# EAGLE schematic ABE-Stat1_01_02 (EAGLE 8.4.3)
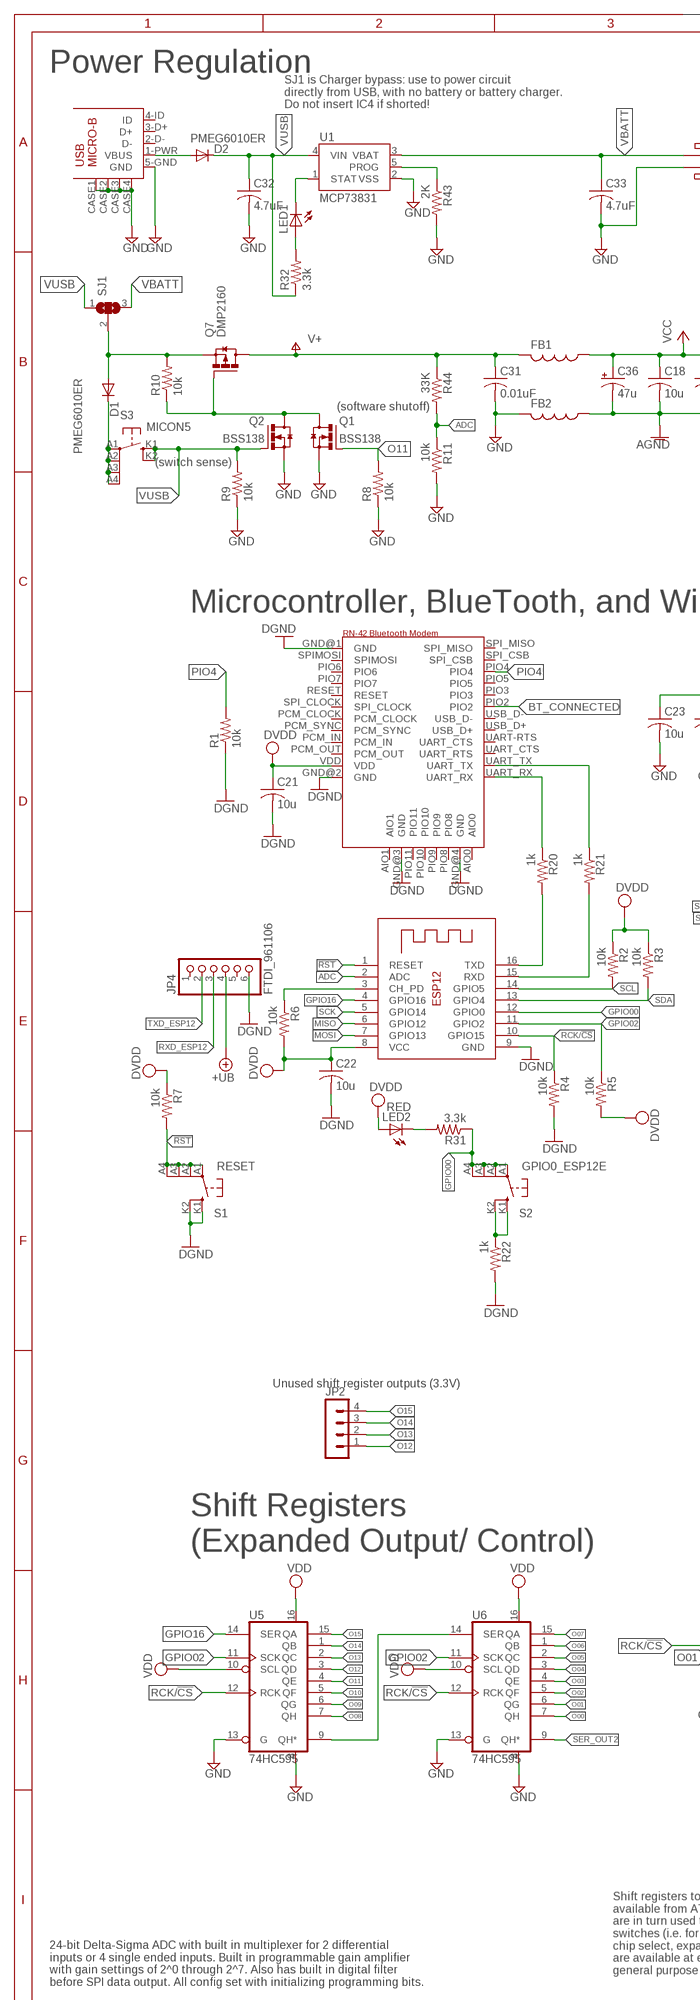
[diagram p0: schematic, sheet 1, part 1 of 2]
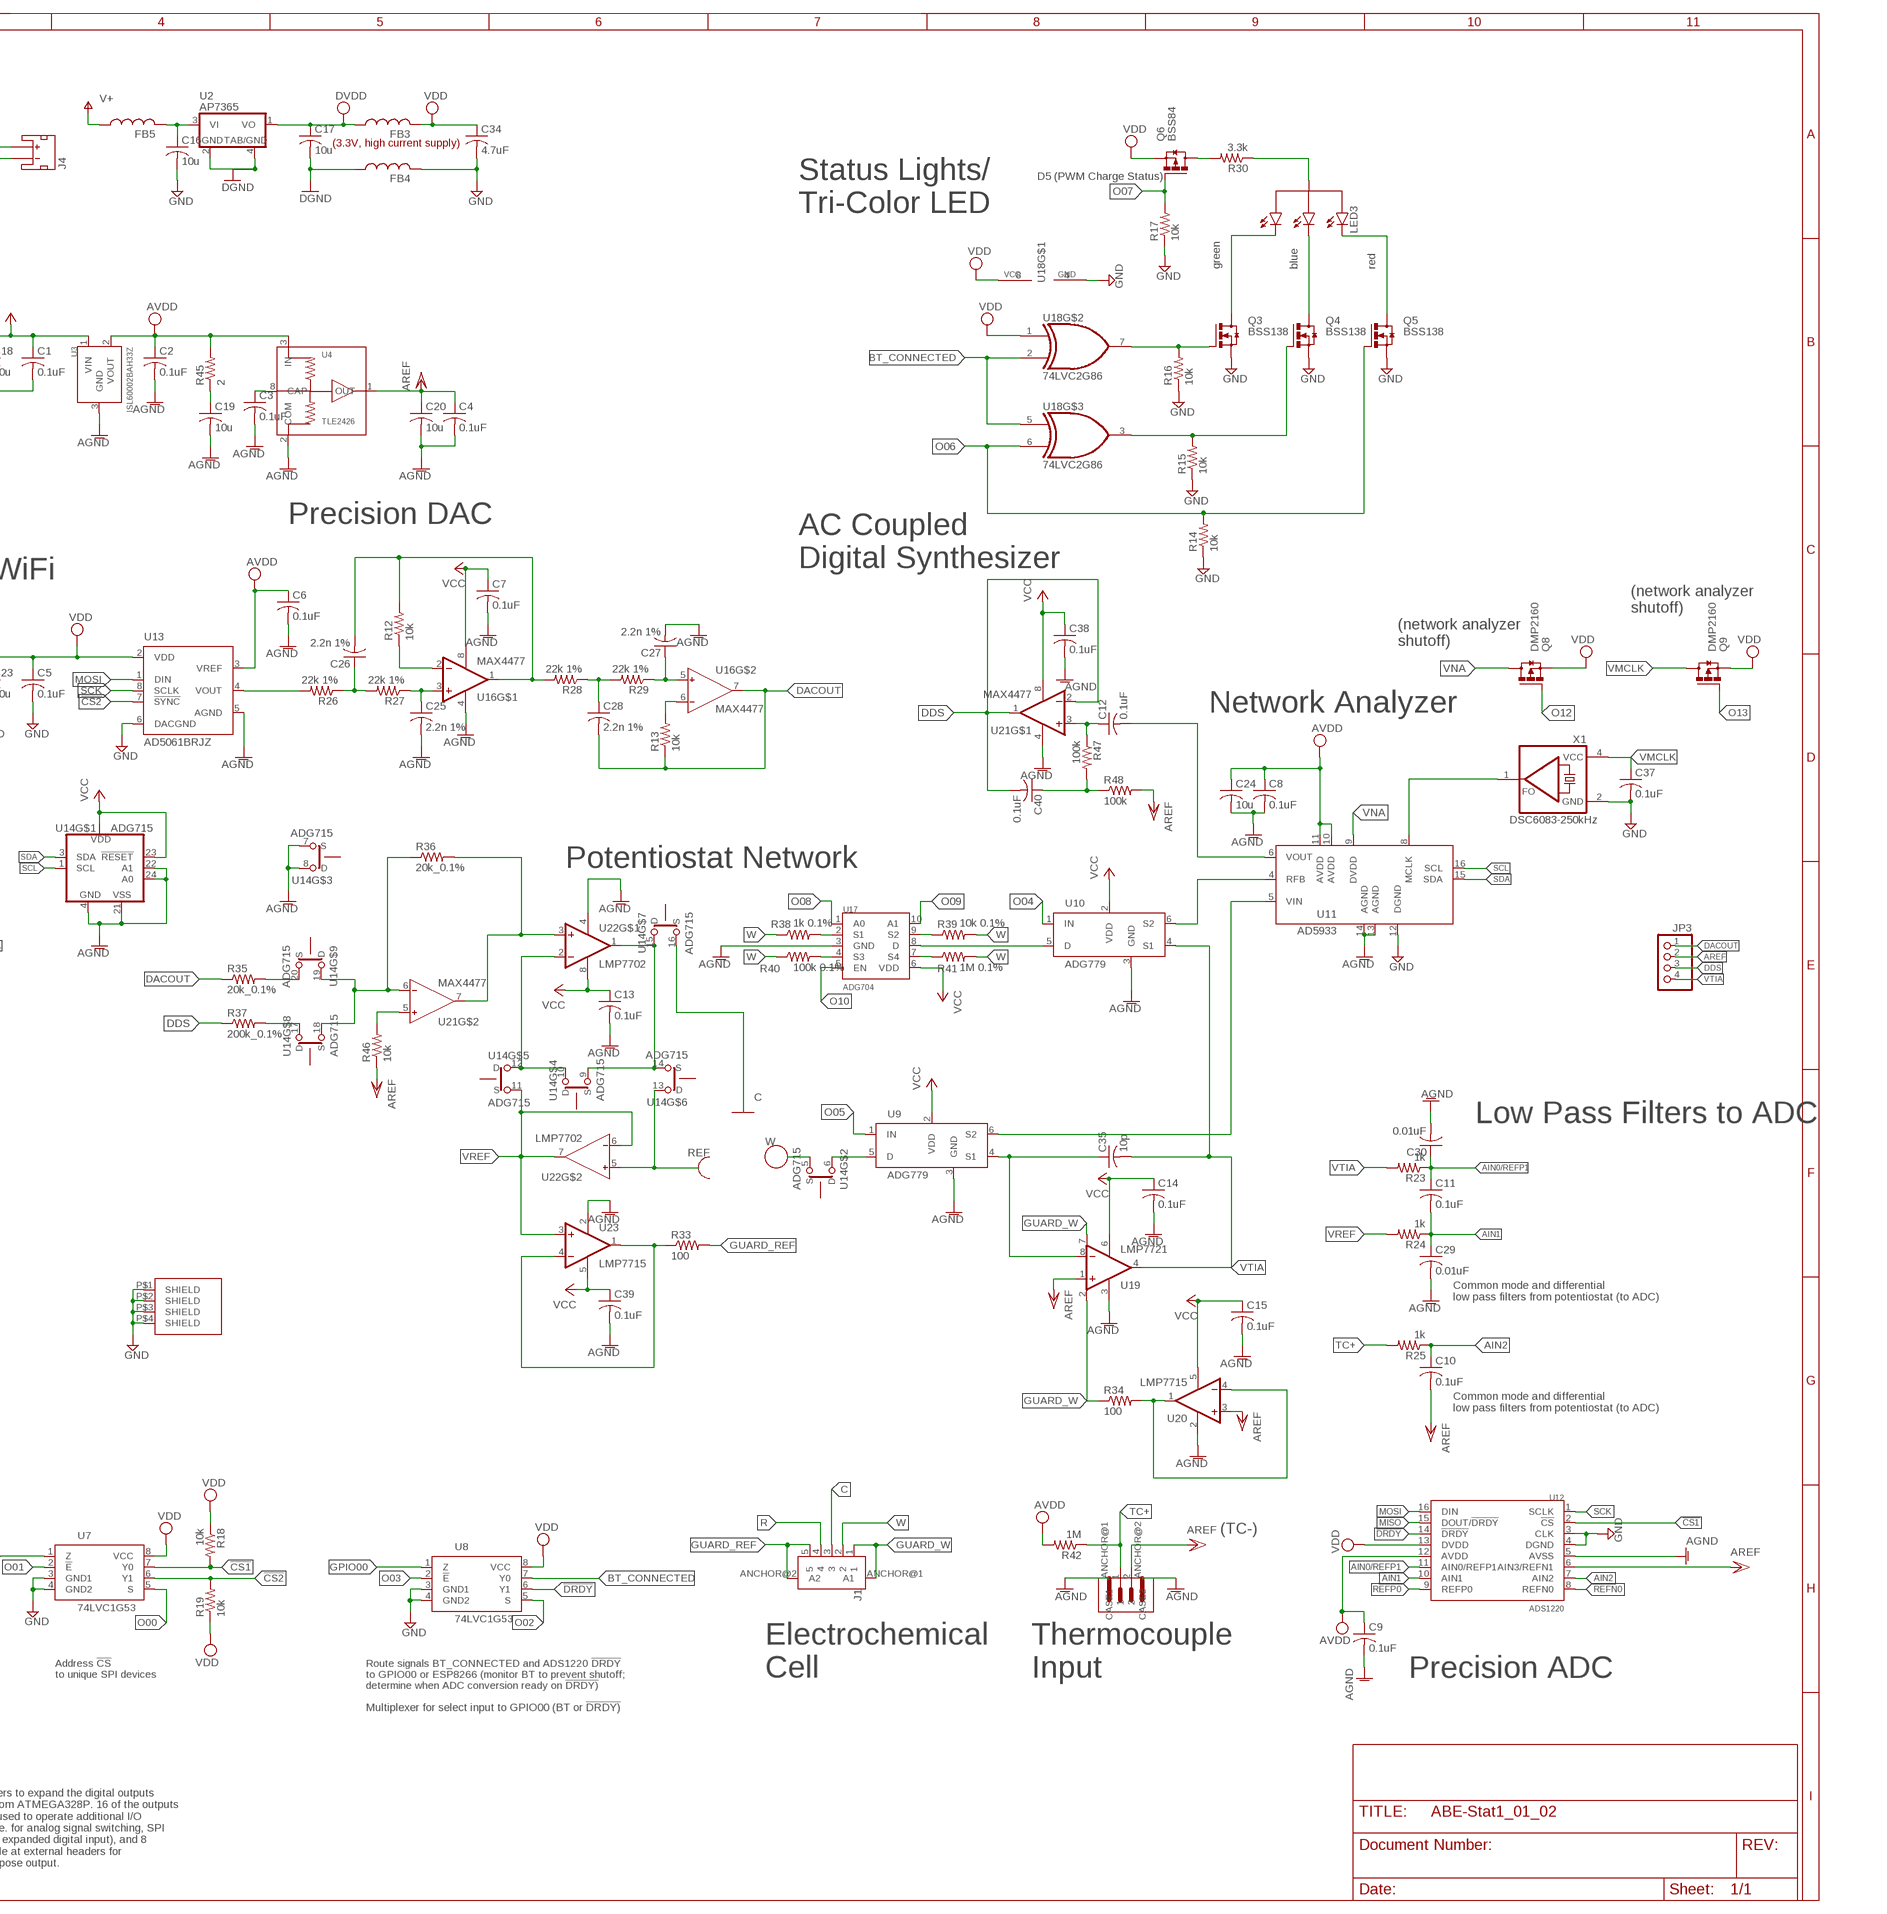
[diagram p1: schematic, sheet 1, part 2 of 2]

## Parts
A1  ESP-12E  ESP-12  [ESP-12]
A2  RN-42_BLUETOOTH  [RN-42]
C1  0.1uF  C-USC0805  [C0805]
C2  0.1uF  C-USC0805  [C0805]
C3  0.1uF  C-USC0805  [C0805]
C4  0.1uF  C-USC0805  [C0805]
C5  0.1uF  C-USC0805  [C0805]
C6  0.1uF  C-USC0805  [C0805]
C7  0.1uF  C-USC0805  [C0805]
C8  0.1uF  C-USC0805  [C0805]
C9  0.1uF  C-USC0805  [C0805]
C10  0.1uF  C-USC0805  [C0805]
C11  0.1uF  C-USC0805  [C0805]
C12  0.1uF  C-USC0805  [C0805]
C13  0.1uF  C-USC0805  [C0805]
C14  0.1uF  C-USC0805  [C0805]
C15  0.1uF  C-USC0805  [C0805]
C16  10u  C-USC0805  [C0805]
C17  10u  C-USC0805  [C0805]
C18  10u  C-USC0805  [C0805]
C19  10u  C-USC0805  [C0805]
C20  10u  C-USC0805  [C0805]
C21  10u  C-USC0805  [C0805]
C22  10u  C-USC0805  [C0805]
C23  10u  C-USC0805  [C0805]
C24  10u  C-USC0805  [C0805]
C25  2.2n 1%  C-USC0805  [C0805]
C26  2.2n 1%  C-USC0805  [C0805]
C27  2.2n 1%  C-USC0805  [C0805]
C28  2.2n 1%  C-USC0805  [C0805]
C29  0.01uF  C-USC0805  [C0805]
C30  0.01uF  C-USC0805  [C0805]
C31  0.01uF  C-USC0805  [C0805]
C32  4.7uF  C-USC0805  [C0805]
C33  4.7uF  C-USC0805  [C0805]
C34  4.7uF  C-USC0805  [C0805]
C35  10p  C-USC0805  [C0805]
C36  47u  CPOL-USD/7343-31W  [D/7343-31W]
C37  0.1uF  C-USC0805  [C0805]
C38  0.1uF  C-USC0805  [C0805]
C39  0.1uF  C-USC0805  [C0805]
C40  0.1uF  C-USC0805  [C0805]
D1  PMEG6010ER  DIODE_DIODE-SOD123  [DIODE_SOD123]
D2  PMEG6010ER  DIODE_DIODE-SOD123  [DIODE_SOD123]
FB1  FERRITE_BEAD_5A_0805  [R0805]
FB2  FERRITE_BEAD_5A_0805  [R0805]
FB3  FERRITE_BEAD_5A_0805  [R0805]
FB4  FERRITE_BEAD_5A_0805  [R0805]
FB5  FERRITE_BEAD_5A_0805  [R0805]
J1  5-PIN-VERTICAL-PHOENIX_2.5MM-SMD  [5-PIN-VERT_PHOENIX_SMD]
J2  1A_JENKINS_2013_2PIN_SMD_PHOENIX_CONTACTVERTICAL  [2-PIN-VERT_PHOENIX_SMD]
J3  USB-MICRO-B  [USB_MICRO_B_WURTH_629105136821]
J4  JST_2MM_MALE  [JST-2-SMD]
JP2  MA04-1  [MA04-1]
JP3  PINHD-1X4  [1X04]
JP4  FTDI_961106  6X1_HEADER_SMT_3M_961106  [6_PIN_0.1IN_STRAIGHT_HEADER]
LED1  LEDCHIPLED_1206  [CHIPLED_1206]
LED2  RED  LED1206  [LED-1206]
LED3  LED_RBG_COM_ANODE  [LED_RGB_WURTH_150141M173100]
Q1  BSS138  BSS138_N_CHANNEL_MOSFET  [SOT-23]
Q2  BSS138  BSS138_N_CHANNEL_MOSFET  [SOT-23]
Q3  BSS138  BSS138_N_CHANNEL_MOSFET  [SOT-23]
Q4  BSS138  BSS138_N_CHANNEL_MOSFET  [SOT-23]
Q5  BSS138  BSS138_N_CHANNEL_MOSFET  [SOT-23]
Q6  BSS84  BSS84_P_CHANNEL_MOSFET  [SOT-23-3]
Q7  DMP2160  [SOT-23-3]
Q8  DMP2160  [SOT-23-3]
Q9  DMP2160  [SOT-23-3]
R1  10k  R-US_R0805  [R0805]
R2  10k  R-US_R0805  [R0805]
R3  10k  R-US_R0805  [R0805]
R4  10k  R-US_R0805  [R0805]
R5  10k  R-US_R0805  [R0805]
R6  10k  R-US_R0805  [R0805]
R7  10k  R-US_R0805  [R0805]
R8  10k  R-US_R0805  [R0805]
R9  10k  R-US_R0805  [R0805]
R10  10k  R-US_R0805  [R0805]
R11  10k  R-US_R0805  [R0805]
R12  10k  R-US_R0805  [R0805]
R13  10k  R-US_R0805  [R0805]
R14  10k  R-US_R0805  [R0805]
R15  10k  R-US_R0805  [R0805]
R16  10k  R-US_R0805  [R0805]
R17  10k  R-US_R0805  [R0805]
R18  10k  R-US_R0805  [R0805]
R19  10k  R-US_R0805  [R0805]
R20  1k  R-US_R0805  [R0805]
R21  1k  R-US_R0805  [R0805]
R22  1k  R-US_R0805  [R0805]
R23  1k  R-US_R0805  [R0805]
R24  1k  R-US_R0805  [R0805]
R25  1k  R-US_R0805  [R0805]
R26  22k 1%  R-US_R0805  [R0805]
R27  22k 1%  R-US_R0805  [R0805]
R28  22k 1%  R-US_R0805  [R0805]
R29  22k 1%  R-US_R0805  [R0805]
R30  3.3k  R-US_R0805  [R0805]
R31  3.3k  R-US_R0805  [R0805]
R32  3.3k  R-US_R0805  [R0805]
R33  100  R-US_R0805  [R0805]
R34  100  R-US_R0805  [R0805]
R35  20k_0.1%  R-US_R0805  [R0805]
R36  20k_0.1%  R-US_R0805  [R0805]
R37  200k_0.1%  R-US_R0805  [R0805]
R38  1k 0.1%  R-US_R0805  [R0805]
R39  10k 0.1%  R-US_R0805  [R0805]
R40  100k 0.1%  R-US_R0805  [R0805]
R41  1M 0.1%  R-US_R0805  [R0805]
R42  1M  R-US_R0805  [R0805]
R43  2K  R-US_R0805  [R0805]
R44  33K  R-US_R0805  [R0805]
R45  2  R-US_R2512  [R2512]
R46  10k  R-US_R0805  [R0805]
R47  100k  R-US_R0805  [R0805]
R48  100k  R-US_R0805  [R0805]
S1  RESET  RAFI-MICON5-SPST  [RAFI-MICON5_SWITCH]
S2  GPIO0_ESP12E  RAFI-MICON5-SPST  [RAFI-MICON5_SWITCH]
S3  MICON5  RAFI-MICON5-SPST  [RAFI-MICON5_SWITCH]
SH1  SMARTDART_SHIELD  [SMARTDART-SHIELD]
SJ1  SJ2W  [SJ_2]
U1  MCP73831  MCP73831SMD  [SOT23-5]
U2  AP7365  AD7365_3.3V_LDO_600MA  [SOT-223]
U3  ISL60002BAH33Z  ISL21080_0.9V_REF  [SOT-23-3]
U4  TLE2426  TLE2426_RAIL_SPLITTER  [SOIC-8]
U5  74HC595  MM74HC595  [TSSOP16]
U6  74HC595  MM74HC595  [TSSOP16]
U7  74LVC1G53  [VSSOP8]
U8  74LVC1G53  [VSSOP8]
U9  ADG779  [SC70-6]
U10  ADG779  [SC70-6]
U11  AD5933  AD5933SSOP-16  [SSOP-16]
U12  ADS1220  [TSSOP16]
U13  AD5061BRJZ  [SOT-23-8]
U14  ADG715  [TSSOP24]
U16  MAX4477  MAX4477_DUAL_OPAMP  [UMAX8]
U17  ADG704  [MSOP10]
U18  74LVC2G86  74LVC2G86_DUAL_XOR  [US-8]
U19  LMP7721  LMP7721_GUARD  [SOIC-8]
U20  LMP7715  [SOT23-5]
U21  MAX4477  MAX4477_DUAL_OPAMP  [UMAX8]
U22  LMP7702  [MSOP8]
U23  LMP7715  [SOT23-5]
X1  DSC6083-250kHz  DSC6083_250KHZ_OSCILLATOR  [DSC60XX_OSCILLATOR_3.2X2.5MM]

## Nets
!CS1: R18.2 U7.7(Y0) U12.2(!CS)
!CS2: R19.2 U7.6(Y1) U13.7(!SYNC)
!DRDY: U8.6(Y1) U12.14(!DRDY)
!RST: A1.1(RESET) R7.2 S1.A1(P) S1.A2(P1) S1.A3(P2) S1.A4(P3)
+UB: JP4.4
AD5933_VIN: U9.6(S2) U11.5(VIN)
ADC: A1.2(ADC) R11.1 R44.2
AGND: C1.2 C2.2 C3.2 C4.2 C6.2 C7.2 C8.2 C9.2 C13.2 C14.2 C15.2 C18.2 C19.2 C20.2 C24.2 C25.2 C27.2 C29.2 C30.2 C36.- C38.2 C39.2 FB2.1 J2.ANCHOR@1(CASE1) J2.ANCHOR@2(CASE2) U3.3(GND) U4.2(COM) U9.3(GND) U10.3(GND) U11.13(AGND) U11.14(AGND) U12.5(AVSS) U13.5(AGND) U14.4(GND) U14.7(S) U14.8(D) U14.21(VSS) U14.22(A1) U14.24(A0) U16.4(V-) U17.3(GND) U19.3(V-) U20.2(V-) U21.4(V-) U22.4(V-) U23.2(V-)
AIN0/REFP1: C11.1 C30.1 R23.1 U12.11(AIN0/REFP1)
AIN1: C11.2 C29.1 R24.1 U12.10(AIN1)
AIN2: C10.1 R25.1 U12.7(AIN2)
AREF: C4.1 C10.2 C20.1 J2.2 JP3.2 R46.1 R48.2 U4.1(OUT) U12.6(AIN3/REFN1) U19.1(+IN) U20.3(+IN)
AVDD: C2.1 C6.1 C8.1 C9.1 C24.1 R42.2 R45.2 U3.2(VOUT) U4.3(IN) U11.10(AVDD) U11.11(AVDD) U12.12(AVDD) U13.3(VREF)
BT_CONNECTED: A2.PIO2 U8.7(Y0) U18.2(I1) U18.5(I0)
C: J1.3 U14.16(S)
DACOUT: C28.2 JP3.1 R13.1 R35.1 U16.7(OUT)
DDS: C40.2 JP3.3 R37.1 U21.1(OUT) U21.2(-IN)
DGND: A1.9(GND) A2.GND@1(GND) A2.GND@2(GND) A2.GND@3(GND) A2.GND@4(GND) C17.2 C21.2 C22.2 FB4.1 JP4.6 R1.1 R4.2 R22.2 S1.K1(S) S1.K2(S1) U2.2(GND) U2.4(GND1)
DVDD: A1.8(VCC) A2.VDD C17.1 C21.1 C22.1 FB3.1 LED2.A R2.1 R3.1 R5.2 R6.2 R7.1 U2.1(VO)
GND: C5.2 C16.2 C23.2 C31.2 C32.2 C33.2 C34.2 C37.2 FB2.2 FB4.2 J3.5-GND(GND) J3.CASE1(CASE) J3.CASE2(CASE) J3.CASE3(CASE) J3.CASE4(CASE) J4.1(-) Q1.2-S(S) Q2.2-S(S) Q3.2-S(S) Q4.2-S(S) Q5.2-S(S) R8.1 R9.1 R11.2 R14.1 R15.1 R16.1 R17.1 R43.2 SH1.P$1(SHIELD) SH1.P$2(SHIELD) SH1.P$3(SHIELD) SH1.P$4(SHIELD) U1.2(VSS) U5.8(GND) U5.13(G) U6.8(GND) U6.13(G) U7.3(GND1) U7.4(GND2) U8.3(GND1) U8.4(GND2) U11.12(DGND) U12.3(CLK) U12.4(DGND) U13.6(DACGND) U18.4(GND) X1.2(GND)
GPIO00: A1.12(GPIO0) R31.1 S2.A1(P) S2.A2(P1) S2.A3(P2) S2.A4(P3) U8.1(Z)
GPIO02: A1.11(GPIO2) R5.1 U5.11(SCK) U6.11(SCK)
GPIO16: A1.4(GPIO16) U5.14(SER)
GUARD_REF: J1.5 J1.ANCHOR@2(A2) R33.2
GUARD_W: J1.1 J1.ANCHOR@1(A1) R34.1 U19.2(GUARD) U19.7(GUARD)
MISO: A1.6(GPIO12) U12.15(DOUT/!DRDY)
MOSI: A1.7(GPIO13) U12.16(DIN) U13.1(DIN)
N$1: A2.UART_RX R20.1
N$2: U14.10(D) U14.12(D) U22.2(-IN)
N$3: D2.A J3.1-PWR(VBUS)
N$4: A2.UART_TX R21.1
N$5: Q3.1-G(G) R16.2 U18.7(O)
N$6: U9.5(D) U14.6(D)
N$7: R43.1 U1.5(PROG)
N$8: U5.9(QH*) U6.14(SER)
N$9: C25.1 R27.1 U16.3(+IN)
N$10: LED1.C U1.1(STAT)
N$11: R26.2 U13.4(VOUT)
N$12: LED1.A R32.2
N$13: C19.1 R45.1
N$14: R37.2 U14.17(D)
N$15: C26.1 R26.1 R27.2
N$16: R22.1 S2.K1(S) S2.K2(S1)
N$17: Q4.1-G(G) R15.2 U18.3(O)
N$18: D1.C S3.A1(P) S3.A2(P1) S3.A3(P2) S3.A4(P3)
N$19: C3.1 U4.8(CAP)
N$20: C26.2 R12.2 R28.2 U16.1(OUT)
N$21: C28.1 R28.1 R29.2
N$22: C27.1 R29.1 U16.5(IN+)
N$23: R12.1 U16.2(-IN)
N$24: U14.9(S) U14.14(S) U14.15(D) U22.1(OUT)
N$25: R13.2 U16.6(IN-)
N$26: LED2.C R31.2
N$28: C35.1 U9.4(S1) U19.8(-IN)
N$29: R36.1 U14.18(S) U14.19(D) U21.6(IN-)
N$30: R36.2 U21.7(OUT) U22.3(+IN)
N$31: U10.6(S2) U11.4(RFB)
N$32: R41.1 U17.7(S4)
N$33: R33.1 U23.1(OUT) U23.4(-IN)
N$34: R39.1 U17.9(S2)
N$35: Q1.3-D(D) Q2.3-D(D) Q7.1(G) R10.1
N$36: U10.5(D) U17.8(D)
N$37: R38.2 U17.2(S1)
N$38: R40.2 U17.4(S3)
N$39: LED3.G Q3.3-D(D)
N$40: R34.2 U20.1(OUT) U20.4(-IN)
N$41: LED3.B Q4.3-D(D)
N$42: LED3.R Q5.3-D(D)
N$43: Q6.3(D) R30.2
N$44: LED3.A R30.1
N$45: R35.2 U14.20(S)
N$46: C16.1 FB5.2 U2.3(VI)
N$47: A1.3(CH_PD) R6.1
N$48: U11.8(MCLK) X1.1(FO)
N$49: D1.A Q7.2(S) R10.2 SJ1.2
N$50: R46.2 U21.5(IN+)
N$51: C40.1 R47.2 R48.1
N$52: C12.1 R47.1 U21.3(+IN)
N$53: C12.2 U11.6(VOUT)
O00: U6.7(QH) U7.5(S)
O01: U6.6(QG) U7.2(!E)
O02: U6.5(QF) U8.5(S)
O03: U6.4(QE) U8.2(!E)
O04: U6.3(QD) U10.1(IN)
O05: U6.2(QC) U9.1(IN)
O06: Q5.1-G(G) R14.2 U6.1(QB) U18.6(I1)
O07: Q6.1(G) R17.2 U6.15(QA)
O08: U5.7(QH) U17.1(A0)
O09: U5.6(QG) U17.10(A1)
O10: U5.5(QF) U17.5(EN)
O11: Q1.1-G(G) R8.2 U5.4(QE)
O12: JP2.1 Q8.1(G) U5.3(QD)
O13: JP2.2 Q9.1(G) U5.2(QC)
O14: JP2.3 U5.1(QB)
O15: JP2.4 U5.15(QA)
PIO4: A2.PIO4 R1.2
R: J1.4 U14.13(D) U22.5(IN+)
RCK/!CS: A1.10(GPIO15) R4.1 U5.12(RCK) U6.12(RCK) U7.1(Z)
REFN0: U12.8(REFN0)
REFP0: U12.9(REFP0)
RXD_ESP12: A1.15(RXD) JP4.3 R21.2
SCK: A1.5(GPIO14) U12.1(SCLK) U13.8(SCLK)
SCL: A1.14(GPIO5) R2.2 U11.16(SCL) U14.1(SCL)
SDA: A1.13(GPIO4) R3.2 U11.15(SDA) U14.3(SDA)
SER_OUT2: U6.9(QH*)
TC+: J2.1 R25.2 R42.1
TXD_ESP12: A1.16(TXD) JP4.2 R20.2
V+: C31.1 FB1.2 FB5.1 Q7.3(D) R44.1
VBATT: C33.1 J4.2(+) SJ1.3 U1.3(VBAT)
VCC: C1.1 C7.1 C13.1 C14.1 C15.1 C18.1 C36.+ C38.1 C39.1 FB1.1 U3.1(VIN) U9.2(VDD) U10.2(VDD) U14.2(VDD) U14.23(!RESET) U16.8(V+) U17.6(VDD) U19.6(V+) U20.5(V+) U21.8(V+) U22.8(V+) U23.5(V+)
VDD: C5.1 C23.1 C34.1 FB3.2 Q6.2(S) Q8.2(S) Q9.2(S) R18.1 R19.1 U5.10(SCL) U5.16(VCC) U6.10(SCL) U6.16(VCC) U7.8(VCC) U8.8(VCC) U12.13(DVDD) U13.2(VDD) U18.1(I0) U18.8(VCC)
VMCLK: C37.1 Q9.3(D) X1.4(VCC)
VNA: Q8.3(D) U11.9(DVDD)
VREF: R24.2 U14.11(S) U22.6(IN-) U22.7(OUT) U23.3(+IN)
VTIA: C35.2 JP3.4 R23.2 U10.4(S1) U19.4(OUT)
VUSB: C32.1 D2.C Q2.1-G(G) R9.2 R32.1 S3.K1(S) S3.K2(S1) SJ1.1 U1.4(VIN)
W: J1.2 R38.1 R39.2 R40.1 R41.2 U14.5(S)
Unconnected: A2.AIO0 A2.AIO1 A2.PCM_CLOCK A2.PCM_IN A2.PCM_OUT A2.PCM_SYNC A2.PIO3 A2.PIO5 A2.PIO6 A2.PIO7 A2.PIO8 A2.PIO9 A2.PIO10 A2.PIO11 A2.RESET A2.SPI_CLOCK A2.SPI_CSB A2.SPI_MISO A2.SPIMOSI A2.UART-RTS(UART_CTS) A2.UART_CTS(UART_RTS) A2.USB_D+ A2.USB_D- J3.2-D-(D-) J3.3-D+(D+) J3.4-ID(ID) J4.NC1(PAD1) J4.NC2(PAD2) JP4.1 JP4.5

## Notes on the sheet
- Power Regulation
- SJ1 is Charger bypass: use to power circuit
  directly from USB, with no battery or battery charger.
  Do not insert IC4 if shorted!
- (3.3V, high current supply)
- D5 (PWM Charge Status)
- Status Lights/
  Tri-Color LED
- green | blue | red
- (software shutoff)
- (switch sense)
- Precision DAC
- AC Coupled
  Digital Synthesizer
- Microcontroller, BlueTooth, and WiFi
- (network analyzer
  shutoff)
- (network analyzer
  shutoff)
- Network Analyzer
- Potentiostat Network
- Low Pass Filters to ADC
- W
- REF
- Common mode and differential
  low pass filters from potentiostat (to ADC)
- Unused shift register outputs (3.3V)
- Common mode and differential
  low pass filters from potentiostat (to ADC)
- Shift Registers
  (Expanded Output/ Control)
- (TC-)
- Address !CS
  to unique SPI devices
- Electrochemical
  Cell
- Thermocouple
  Input
- Precision ADC
- Route signals BT_CONNECTED and ADS1220 !DRDY
  to GPIO00 or ESP8266 (monitor BT to prevent shutoff;
  determine when ADC conversion ready on !DRDY)
- Multiplexer for select input to GPIO00 (BT or !DRDY)
- Shift registers to expand the digital outputs
  available from ATMEGA328P. 16 of the outputs
  are in turn used to operate additional I/O
  switches (i.e. for analog signal switching, SPI
  chip select, expanded digital input), and 8
  are available at external headers for 
  general purpose output.
- 24-bit Delta-Sigma ADC with built in multiplexer for 2 differential 
  inputs or 4 single ended inputs. Built in programmable gain amplifier 
  with gain settings of 2^0 through 2^7. Also has built in digital filter 
  before SPI data output. All config set with initializing programming bits.

## Library data of the parts
A1 = adafruit:ESP-12
A2 = be-420-custom-parts:RN-42_BLUETOOTH
C1-C35 C37-C40 = rcl:C-US: CAPACITOR, American symbol
C36 = rcl:CPOL-US: POLARIZED CAPACITOR, American symbol
D1 D2 = BE 420 Parts volume 2:DIODE_DIODE-: DIODE
FB1-FB5 = 1A_Jenkins_2013:FERRITE_BEAD_5A_0805
J1 = 1A-Jenkins Phoenix Contact Connectors:5-PIN-VERTICAL-PHOENIX_2.5MM-SMD
J2 = 1A-Jenkins Phoenix Contact Connectors:1A_JENKINS_2013_2PIN_SMD_PHOENIX_CONTACT
J3 = 1A_Jenkins_2013:USB-MICRO-B
J4 = SparkFun-Connectors:JST_2MM_MALE: JST 2MM MALE RA CONNECTOR Two pin, compact surface mount connector. Commonly used as a battery input connection point. We really like the solid locking feeling and high current rating on these small connectors. We use these all the time as battery connectors. Mates to single-cell LiPo batteries. Here is the connector we sell at SparkFun: JST Right Angle Connector - White <https://www.sparkfun.com/products/8612> (PRT-08612) Datasheet <http://www.sparkfun.com/datasheets/Prototyping/Connectors/JST-Horizontal.pdf> It was used on these SparkFun products: SparkFun MOSFET Power Controller <https://www.sparkfun.com/products/11214> (PRT-11214) SparkFun Battery Babysitter - LiPo Battery Manager <https://www.sparkfun.com/products/13777> (PRT-13777) And many, many others that required a lipo battery connection.; PROD_ID: CONN-11443; SF_ID: PRT-08612
JP2 = con-lstb:MA04-1: PIN HEADER; OC_FARNELL: unknown; OC_NEWARK: unknown
JP3 = pinhead:PINHD-1X4: PIN HEADER
JP4 = 1A_Jenkins_2013:6X1_HEADER_SMT_3M_961106
LED1 = led:LED: LED OSRAM: - CHIPLED LG R971, LG N971, LY N971, LG Q971, LY Q971, LO R971, LY R971 LH N974, LH R974 LS Q976, LO Q976, LY Q976 LO Q996 - Hyper CHIPLED LW Q18S LB Q993, LB Q99A, LB R99A - SideLED LS A670, LO A670, LY A670, LG A670, LP A670 LB A673, LV A673, LT A673, LW A673 LH A674 LY A675 LS A676, LA A676, LO A676, LY A676, LW A676 LS A679, LY A679, LG A679 - Hyper Micro SIDELED® LS Y876, LA Y876, LO Y876, LY Y876 LT Y87S - SmartLED LW L88C, LW L88S LB L89C, LB L89S, LG L890 LS L89K, LO L89K, LY L89K LS L896, LA L896, LO L896, LY L896 - TOPLED LS T670, LO T670, LY T670, LG T670, LP T670 LSG T670, LSP T670, LSY T670, LOP T670, LYG T670 LG T671, LOG T671, LSG T671 LB T673, LV T673, LT T673, LW T673 LH T674 LS T676, LA T676, LO T676, LY T676, LB T676, LH T676, LSB T676, LW T676 LB T67C, LV T67C, LT T67C, LS T67K, LO T67K, LY T67K, LW E67C LS E67B, LA E67B, LO E67B, LY E67B, LB E67C, LV E67C, LT E67C LW T67C LS T679, LY T679, LG T679 LS T770, LO T770, LY T770, LG T770, LP T770 LB T773, LV T773, LT T773, LW T773 LH T774 LS E675, LA E675, LY E675, LS T675 LS T776, LA T776, LO T776, LY T776, LB T776 LHGB T686 LT T68C, LB T68C - Hyper Mini TOPLED® LB M676 - Mini TOPLED Santana® LG M470 LS M47K, LO M47K, LY M47K Source: http://www.osram.convergy.de LUXEON: - LUMILED® LXK2-PW12-R00, LXK2-PW12-S00, LXK2-PW14-U00, LXK2-PW14-V00 LXK2-PM12-R00, LXK2-PM12-S00, LXK2-PM14-U00 LXK2-PE12-Q00, LXK2-PE12-R00, LXK2-PE12-S00, LXK2-PE14-T00, LXK2-PE14-U00 LXK2-PB12-K00, LXK2-PB12-L00, LXK2-PB12-M00, LXK2-PB14-N00, LXK2-PB14-P00, LXK2-PB14-Q00 LXK2-PR12-L00, LXK2-PR12-M00, LXK2-PR14-Q00, LXK2-PR14-R00 LXK2-PD12-Q00, LXK2-PD12-R00, LXK2-PD12-S00 LXK2-PH12-R00, LXK2-PH12-S00 LXK2-PL12-P00, LXK2-PL12-Q00, LXK2-PL12-R00 Source: www.luxeon.com KINGBRIGHT: KA-3528ASYC Source: www.kingbright.com
LED2 = SparkFun:LED: LEDs Standard schematic elements and footprints for 5mm, 3mm, 1206, and 0603 sized LEDs. 5mm - Spark Fun Electronics SKU : COM-00529 (and others)
LED3 = 1A_Jenkins_2013:LED_RBG_COM_ANODE
Q1-Q5 = be-420-custom-parts:BSS138_N_CHANNEL_MOSFET
Q6 = 1A_Jenkins_2013:BSS84_P_CHANNEL_MOSFET
Q7-Q9 = 1A_Jenkins_2013:DMP2160
R1-R7 R11-R13 R18-R29 R31-R44 R46-R48 = rcl:R-US_: RESISTOR, American symbol
R8-R10 R14-R17 R30 R45 = resistor:R-US_: RESISTOR, American symbol
S1-S3 = 1A_Jenkins_2013:RAFI-MICON5-SPST
SH1 = 1A_Jenkins_2013:SMARTDART_SHIELD
SJ1 = jumper:SJ2W: SMD solder JUMPER
U1 = SparkFun:MCP73831
U2 = 1A_Jenkins_2013:AD7365_3.3V_LDO_600MA
U3 = 1A_Jenkins_2013:ISL21080_0.9V_REF
U4 = 1A_Jenkins_2013:TLE2426_RAIL_SPLITTER
U5 U6 = 1A_Jenkins_2013:MM74HC595
U7 U8 = 1A_Jenkins_2013:74LVC1G53
U9 U10 = 1A_Jenkins_2013:ADG779
U11 = 1A_Jenkins_2013:AD5933
U12 = 1A_Jenkins_2013:ADS1220
U13 = 1A_Jenkins_2013:AD5061BRJZ
U14 = 1A_Jenkins_2013:ADG715
U16 U21 = 1A_Jenkins_2013:MAX4477_DUAL_OPAMP
U17 = 1A_Jenkins_2013:ADG704
U18 = 1A_Jenkins_2013:74LVC2G86_DUAL_XOR
U19 = 1A_Jenkins_2013:LMP7721_GUARD
U20 U23 = 1A_Jenkins_2013:LMP7715
U22 = 1A_Jenkins_2013:LMP7702
X1 = 1A_Jenkins_2013:DSC6083_250KHZ_OSCILLATOR

## Net classes
1 VCC: width 0.381 mm
2 LEDPower: width 0.203 mm
3 ButtonSignal: width 0.203 mm